# Altium schematic sheet FRONT_BOARD.SchDoc
size A4; SheetNumber: 1; SheetTotal: 1
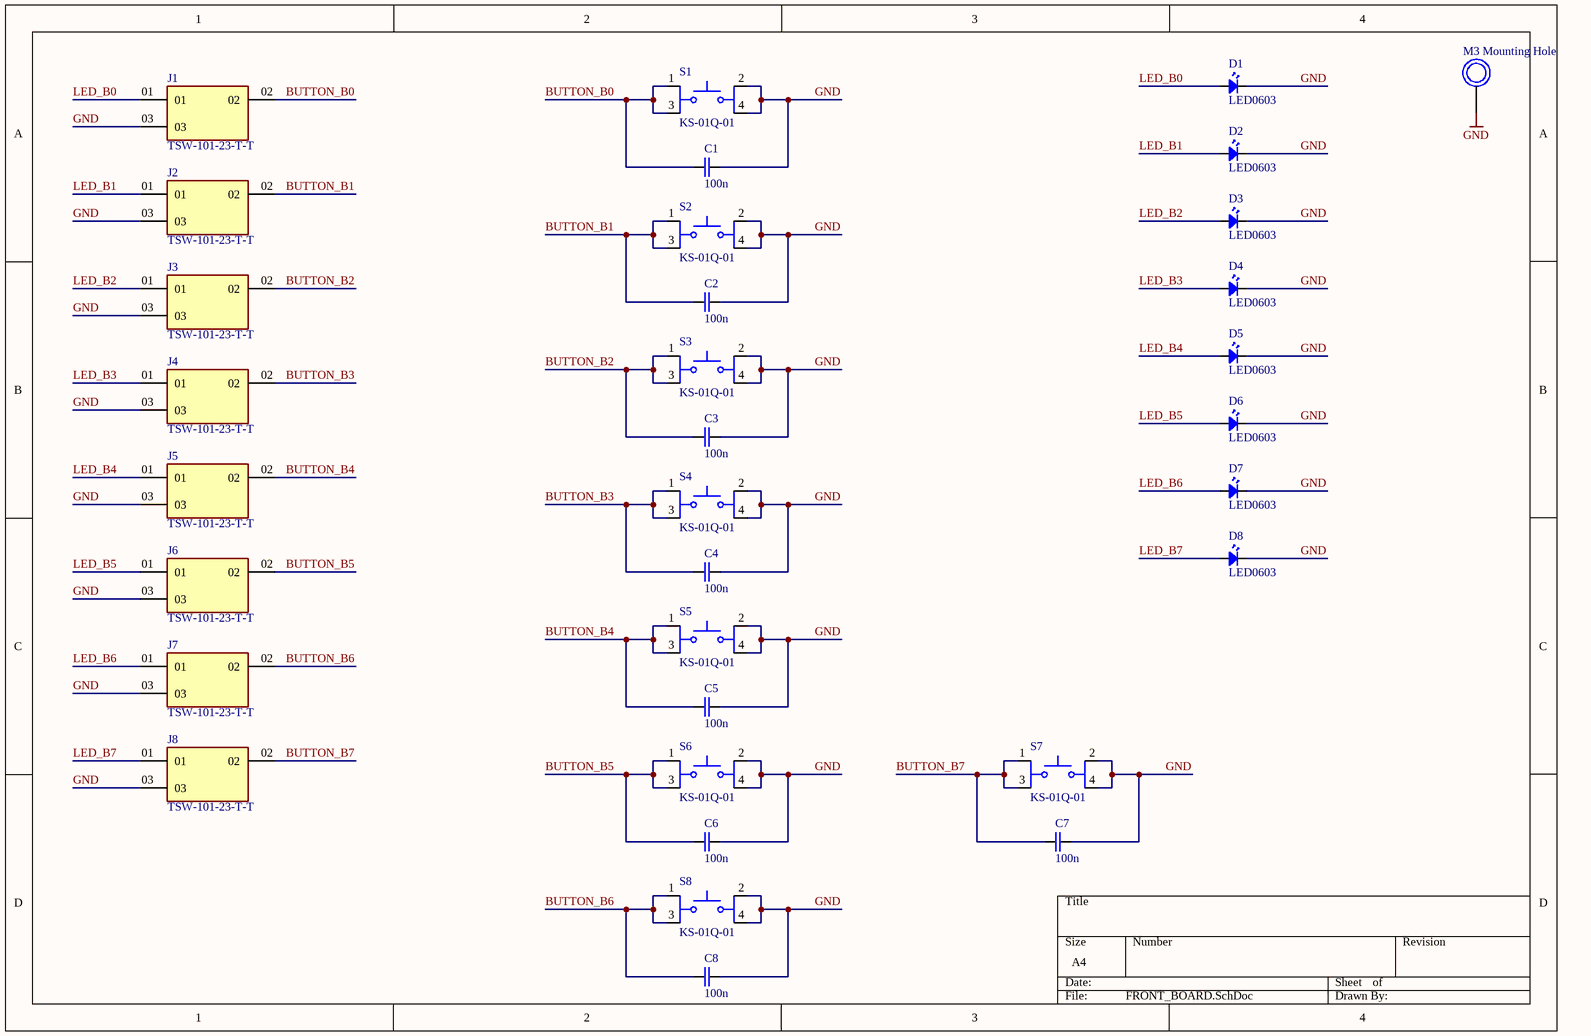
[diagram p0: FRONT_BOARD.SchDoc]

## Parts
C1  100n  [C0603]
C2  100n  [C0603]
C3  100n  [C0603]
C4  100n  [C0603]
C5  100n  [C0603]
C6  100n  [C0603]
C7  100n  [C0603]
C8  100n  [C0603]
D1  LED0603  [LED0603]
D2  LED0603  [LED0603]
D3  LED0603  [LED0603]
D4  LED0603  [LED0603]
D5  LED0603  [LED0603]
D6  LED0603  [LED0603]
D7  LED0603  [LED0603]
D8  LED0603  [LED0603]
J1  TSW-101-23-T-T  [SAMTEC_TSW-101-23-T-T]
J2  TSW-101-23-T-T  [SAMTEC_TSW-101-23-T-T]
J3  TSW-101-23-T-T  [SAMTEC_TSW-101-23-T-T]
J4  TSW-101-23-T-T  [SAMTEC_TSW-101-23-T-T]
J5  TSW-101-23-T-T  [SAMTEC_TSW-101-23-T-T]
J6  TSW-101-23-T-T  [SAMTEC_TSW-101-23-T-T]
J7  TSW-101-23-T-T  [SAMTEC_TSW-101-23-T-T]
J8  TSW-101-23-T-T  [SAMTEC_TSW-101-23-T-T]
MH1  M3 Mounting Hole  [Copy of M4 Mounting Hole]
S1  KS-01Q-01  [SW_KS-01Q-01]
S2  KS-01Q-01  [SW_KS-01Q-01]
S3  KS-01Q-01  [SW_KS-01Q-01]
S4  KS-01Q-01  [SW_KS-01Q-01]
S5  KS-01Q-01  [SW_KS-01Q-01]
S6  KS-01Q-01  [SW_KS-01Q-01]
S7  KS-01Q-01  [SW_KS-01Q-01]
S8  KS-01Q-01  [SW_KS-01Q-01]

## Nets
GND: C1.2 C2.2 C3.2 C4.2 C5.2 C6.2 C7.2 C8.2 D1.K D2.K D3.K D4.K D5.K D6.K D7.K D8.K J1.03 J2.03 J3.03 J4.03 J5.03 J6.03 J7.03 J8.03 MH1.1 S1.2 S1.4 S2.2 S2.4 S3.2 S3.4 S4.2 S4.4 S5.2 S5.4 S6.2 S6.4 S7.2 S7.4 S8.2 S8.4
BUTTON_B0: C1.1 J1.02 S1.1 S1.3
BUTTON_B1: C2.1 J2.02 S2.1 S2.3
BUTTON_B2: C3.1 J3.02 S3.1 S3.3
BUTTON_B3: C4.1 J4.02 S4.1 S4.3
BUTTON_B4: C5.1 J5.02 S5.1 S5.3
BUTTON_B5: C6.1 J6.02 S6.1 S6.3
BUTTON_B6: C8.1 J7.02 S8.1 S8.3
BUTTON_B7: C7.1 J8.02 S7.1 S7.3
LED_B0: D1.A J1.01
LED_B1: D2.A J2.01
LED_B2: D3.A J3.01
LED_B3: D4.A J4.01
LED_B4: D5.A J5.01
LED_B5: D6.A J6.01
LED_B6: D7.A J7.01
LED_B7: D8.A J8.01

## Library data of the parts
C1-C8 = CMP-00024-8: Generic 0603 SMD Ceramic Capacitor
D1-D8 = CMP-00036-7: 0603 LED
MH1 = CONN-00002-1: Manufacturer: Molex
J1-J8 = TSW-101-23-T-T: Package: None; Price: None; Value: *; MP: TSW-101-23-T-T; Availability: Unavailable
S1-S8 = KS-01Q-01: Price: None; MP: KS-01Q-01; Availability: Unavailable; Package: None; Value: *